# EAGLE schematic AQS (EAGLE 9.6.2)

## Sheet 1 of 2
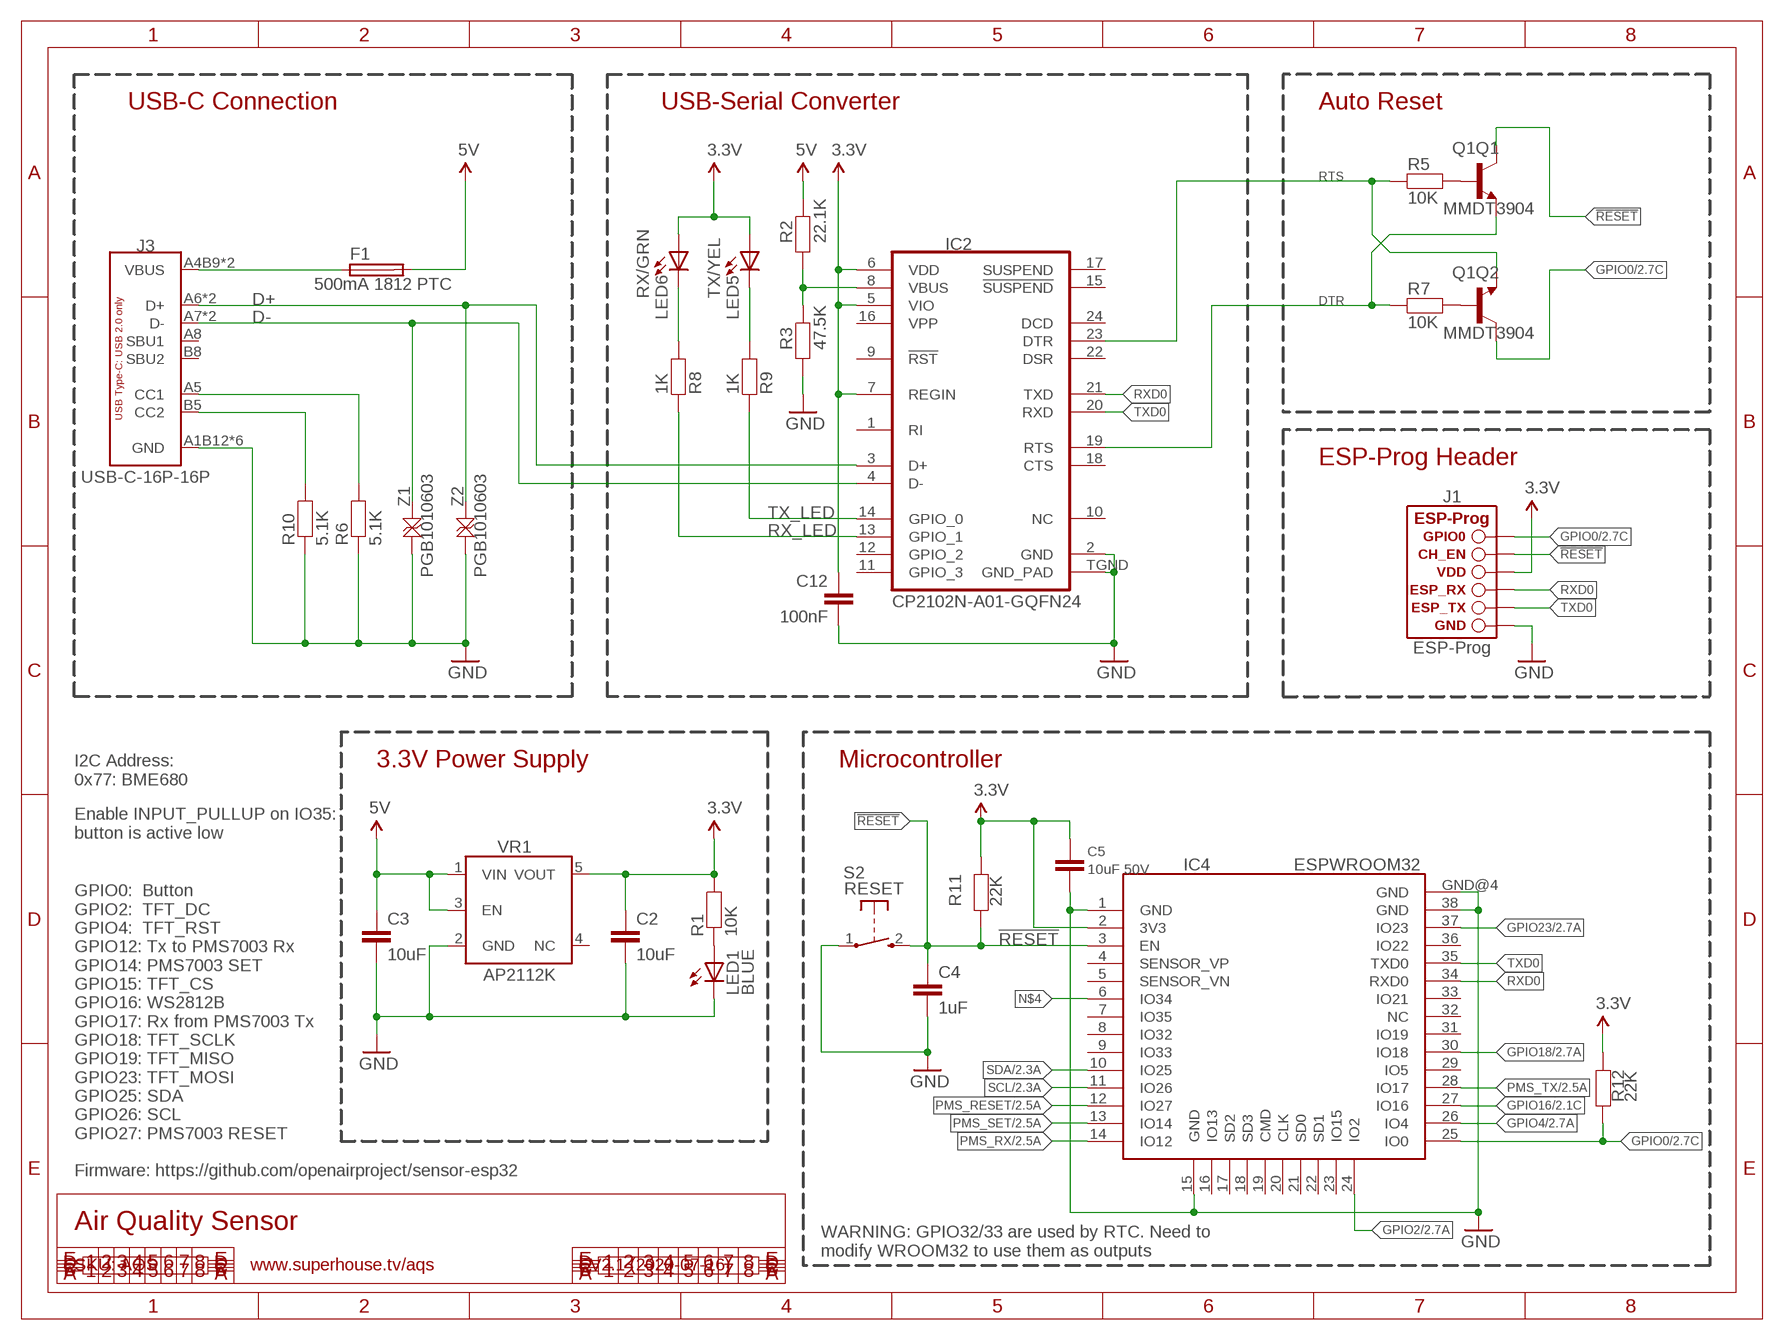
[diagram p0: schematic, sheet 1]

### Parts
C2  10uF  CAP0603  [C0603]
C3  10uF  CAP0603  [C0603]
C4  1uF  CAP0603  [C0603]
C5  10uF 50V  CAP0805  [C0805]
C12  100nF  CAP0603  [C0603]
F1  500mA 1812 PTC  PTC050  [1812]
IC2  CP2102N-A01-GQFN24  CP2104  [QFN-24]
IC4  ESPWROOM32  [ESPWROOM32]
J1  ESP-PROG-2X3-1.27-SHROUDED  [2X3-1.27-SHROUDED]
J3  USB-C-16P-16P  [USB-C-16P]
LED1  BLUE  LED0603  [LED-0603]
LED5  TX/YEL  LED0603  [LED-0603]
LED6  RX/GRN  LED0603  [LED-0603]
Q1  MMDT3904  TRANS_NPN_DUAL-MMDT3904  [SOT-363]
R1  10K  RESISTOR0603  [R0603]
R2  22.1K  RESISTOR0603  [R0603]
R3  47.5K  RESISTOR0603  [R0603]
R5  10K  RESISTOR0603  [R0603]
R6  5.1K  RESISTOR0603  [R0603]
R7  10K  RESISTOR0603  [R0603]
R8  1K  RESISTOR0603  [R0603]
R9  1K  RESISTOR0603  [R0603]
R10  5.1K  RESISTOR0603  [R0603]
R11  22K  RESISTOR0603  [R0603]
R12  22K  RESISTOR0603  [R0603]
S2  RESET  TAC_SWITCH_2PINSMT  [TACTILE_SMT_3X4X2]
VR1  AP2112KSOT25  [SOT23-5]
Z1  PGB1010603  TVS0603  [TVS0603]
Z2  PGB1010603  TVS0603  [TVS0603]

### Nets
3.3V: C2.1 C5.1 C12.1 IC2.5(VIO) IC2.6(VDD) IC2.7(REGIN) IC4.2(3V3) J1.2(VDD) LED5.A LED6.A R1.2 R11.1 R12.1 VR1.5(VOUT) ; also sheet 2
5V: C3.1 F1.2 R2.2 VR1.1(VIN) VR1.3(EN) ; also sheet 2
!RESET: C4.1 IC4.3(EN) J1.1(CH_EN) Q1.3(Q1:C) R11.2 S2.2(S)
D+: IC2.3(D+) J3.A6(D+) J3.B6(D+) Z2.2
D-: IC2.4(D-) J3.A7(D-) J3.B7(D-) Z1.2
DTR: IC2.23(DTR) Q1.1(Q2:E) R5.1
GND: C2.2 C3.2 C4.2 C5.2 C12.2 IC2.2(GND) IC2.TGND(GND_PAD) IC4.1(GND) IC4.15(GND) IC4.38(GND) IC4.GND@4(GND) J1.4(GND) J3.A1B12(GND) J3.A12B1(GND) J3.FIX1(GND) J3.FIX2(GND) J3.FIX3(GND) J3.FIX4(GND) LED1.C R3.1 R6.1 R10.1 S2.1(P) VR1.2(GND) Z1.1 Z2.1 ; also sheet 2
GPIO0: IC4.25(IO0) J1.6(GPIO0) Q1.6(Q2:C) R12.2 ; also sheet 2
GPIO2: IC4.24(IO2) ; also sheet 2
GPIO4: IC4.26(IO4) ; also sheet 2
GPIO16: IC4.27(IO16) ; also sheet 2
GPIO18: IC4.30(IO18) ; also sheet 2
GPIO23: IC4.37(IO23) ; also sheet 2
N$1: LED1.A R1.1
N$2: LED6.C R8.2
N$4: IC4.6(IO34)
N$7: Q1.5(Q1:B) R5.2
N$8: Q1.2(Q2:B) R7.2
N$10: J3.B5(CC2) R10.2
N$11: J3.A5(CC1) R6.2
N$13: LED5.C R9.2
N$39: IC2.8(VBUS) R2.1 R3.2
PMS_RESET: IC4.12(IO27) ; also sheet 2
PMS_RX: IC4.14(IO12) ; also sheet 2
PMS_SET: IC4.13(IO14) ; also sheet 2
PMS_TX: IC4.28(IO17) ; also sheet 2
RTS: IC2.19(RTS) Q1.4(Q1:E) R7.1
RX_LED: IC2.13(GPIO_1) R8.1
RXD0: IC2.21(TXD) IC4.34(RXD0) J1.5(ESP_RX)
SCL: IC4.11(IO26) ; also sheet 2
SDA: IC4.10(IO25) ; also sheet 2
TX_LED: IC2.14(GPIO_0) R9.1
TXD0: IC2.20(RXD) IC4.35(TXD0) J1.3(ESP_TX)
VIN: F1.1 J3.A4B9(VBUS) J3.A9B4(VBUS)
Unconnected: IC2.1(RI) IC2.9(!RST) IC2.10(NC) IC2.11(GPIO_3) IC2.12(GPIO_2) IC2.15(!SUSPEND) IC2.16(VPP) IC2.17(SUSPEND) IC2.18(CTS) IC2.22(DSR) IC2.24(DCD) IC4.4(SENSOR_VP) IC4.5(SENSOR_VN) IC4.7(IO35) IC4.8(IO32) IC4.9(IO33) IC4.16(IO13) IC4.17(SD2) IC4.18(SD3) IC4.19(CMD) IC4.20(CLK) IC4.21(SD0) IC4.22(SD1) IC4.23(IO15) IC4.29(IO5) IC4.31(IO19) IC4.32(NC) IC4.33(IO21) IC4.36(IO22) J3.A8(SBU1) J3.B8(SBU2) VR1.4(NC)

### Notes on the sheet
- USB-C Connection | USB-Serial Converter | Auto Reset
- ESP-Prog Header
- 3.3V Power Supply | Microcontroller
- I2C Address:
  0x77: BME680
- Enable INPUT_PULLUP on IO35:
  button is active low
- GPIO0:  Button
  GPIO2:  TFT_DC
  GPIO4:  TFT_RST
  GPIO12: Tx to PMS7003 Rx
  GPIO14: PMS7003 SET
  GPIO15: TFT_CS
  GPIO16: WS2812B
  GPIO17: Rx from PMS7003 Tx
  GPIO18: TFT_SCLK
  GPIO19: TFT_MISO
  GPIO23: TFT_MOSI
  GPIO25: SDA
  GPIO26: SCL
  GPIO27: PMS7003 RESET
  
  Firmware: https://github.com/openairproject/sensor-esp32
- Air Quality Sensor
- WARNING: GPIO32/33 are used by RTC. Need to
  modify WROOM32 to use them as outputs
- SKU: AQS | www.superhouse.tv/aqs | V2.1 (2020-07-16)

## Sheet 2 of 2
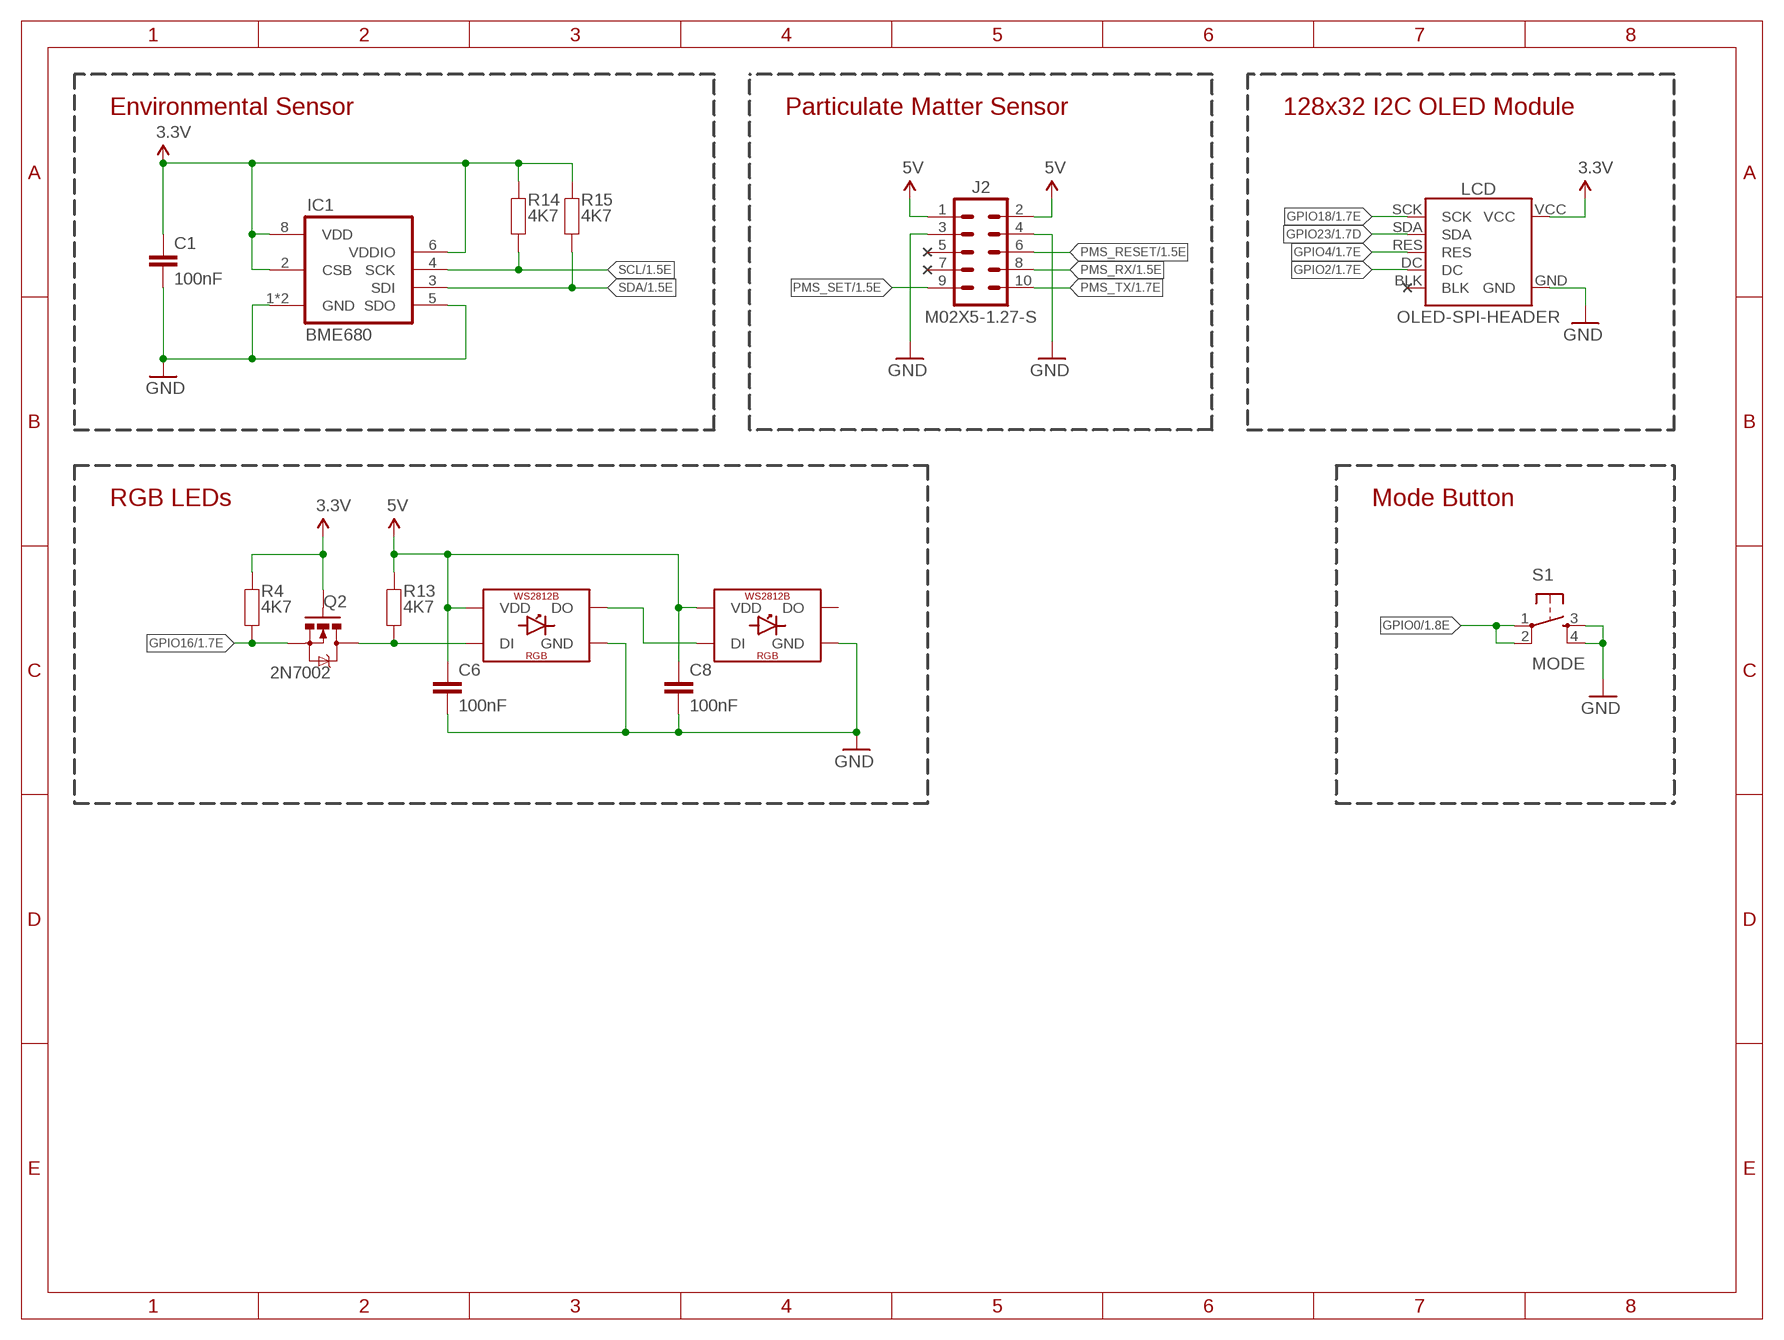
[diagram p1: schematic, sheet 2]

### Parts
C1  100nF  CAP0603  [C0603]
C6  100nF  CAP0603  [C0603]
C8  100nF  CAP0603  [C0603]
IC1  BME680  [BME680]
J2  M02X5-1.27-S  [2X05-1.27-S]
LCD  OLED-SPI-HEADER  [OLED-240X240-1.3-HEADER]
LED2  WS2812B5050  [WS2812B]
LED4  WS2812B5050  [WS2812B]
Q2  2N7002  MOSFET-NCHANNEL-233  [SOT23-3]
R4  4K7  RESISTOR0603  [R0603]
R13  4K7  RESISTOR0603  [R0603]
R14  4K7  RESISTOR0603  [R0603]
R15  4K7  RESISTOR0603  [R0603]
S1  MODE  TAC_SWITCH-PTH-4.5  [TACTILE-PTH-4.5MM]

### Nets
3.3V: C1.1 IC1.2(CSB) IC1.6(VDDIO) IC1.8(VDD) LCD.VCC Q2.1(G) R4.2 R14.2 R15.2 ; also sheet 1
5V: C6.1 C8.1 J2.1 J2.2 LED2.1-VDD(VDD) LED4.1-VDD(VDD) R13.2 ; also sheet 1
GND: C1.2 C6.2 C8.2 IC1.1(GND) IC1.5(SDO) IC1.7(GND) J2.3 J2.4 LCD.GND LED2.3-GND(GND) LED4.3-GND(GND) S1.3 S1.4 ; also sheet 1
GPIO0: S1.1 S1.2 ; also sheet 1
GPIO2: LCD.DC ; also sheet 1
GPIO4: LCD.RES ; also sheet 1
GPIO16: Q2.2(S) R4.1 ; also sheet 1
GPIO18: LCD.SCK ; also sheet 1
GPIO23: LCD.SDA ; also sheet 1
H1: LED2.4-DIN(DI) Q2.3(D) R13.1
N$12: LED2.2-DOUT(DO) LED4.4-DIN(DI)
PMS_RESET: J2.6 ; also sheet 1
PMS_RX: J2.8 ; also sheet 1
PMS_SET: J2.9 ; also sheet 1
PMS_TX: J2.10 ; also sheet 1
SCL: IC1.4(SCK) R14.1 ; also sheet 1
SDA: IC1.3(SDI) R15.1 ; also sheet 1
Unconnected: J2.5 J2.7 LCD.BLK LED4.2-DOUT(DO)

### Notes on the sheet
- Environmental Sensor | Particulate Matter Sensor | 128x32 I2C OLED Module
- RGB LEDs | Mode Button

## Library data of the parts
C1-C6 C8 C12 = SuperHouse-DiscreteSemi:CAP: Capacitor Standard ceramic capacitor
F1 = SuperHouse-Fuses:PTC: MF-SMDF Series - PRC Resettable Fuses Source: http://www.farnell.com/datasheets/716597.pdf
IC1 = SuperHouse-Sensors:BME680: BME680 humdity, pressure, temperature, and gas sensor
IC2 = SuperHouse-ICs:CP2104: CP2104 / CP2102N-A01-GQFN24 CP2104 USB to serial converter. The CP2104 is not recommended for new designs: replace with CP2102N-A01-GQFN24.
IC4 = SuperHouse-MCUs:ESPWROOM32: Espressif WROOM32 ESP32 module
J1 = SuperHouse-ESP-Prog:ESP-PROG: ESP-Prog ESP-Prog programming header for ESP8266, ESP8285, and ESP32. Options for both 1x6 and 2x3 formats, in 2.54mm (0.1") and 1.27mm (0.05") pitch.
J2 = SuperHouse-Connectors:M02X5: M10 header in 2x5 format
J3 = SuperHouse-Connectors:USB-C-16P: USB-C socket with 16 pins, suitable only for backward compatibility with USB 2
LCD = SuperHouse-Displays:OLED-SPI
LED1 LED5 LED6 = SuperHouse-LEDs:LED: LEDs Standard schematic elements and footprints for 5mm, 3mm, 1206, and 0603 sized LEDs. 5mm - Spark Fun Electronics SKU : COM-00529 (and others)
LED2 LED4 = SuperHouse-LEDs:WS2812B: WS2812B addressable RGB LED
Q1 = SuperHouse-DiscreteSemi:TRANS_NPN_DUAL: MMDT3904 Dual 3904 NPN transistors. Datasheet <http://www.onsemi.com/pub_link/Collateral/MBT3904DW1T1-D.PDF>; PROD_ID: TRANS-13337
Q2 = SuperHouse-DiscreteSemi:MOSFET-NCHANNEL: N-channel MOSFET
R1-R15 = SuperHouse-DiscreteSemi:RESISTOR: Resistor Standard resistors.
S1 = SuperHouse-Switches:TAC_SWITCH: Momentary Switch Tactile switch, normally-open.
S2 = SuperHouse-Switches:TAC_SWITCH_2PIN: Momentary Tactile Switch - 2 pin Uxcell 3x4x2mm switch with 2 SMT pads
VR1 = SuperHouse-Regulators:AP2112K: AP2112K LDO linear voltage regulator
Z1 Z2 = SuperHouse-DiscreteSemi:TVS: TVS voltage protection Zener

## Net classes
0 default: width 0.203 mm, drill 0.356 mm, clearance 0.152 mm
1 power: width 0.203 mm, clearance 0.152 mm